# EAGLE design JOYPAD (EAGLE 9.6.2)
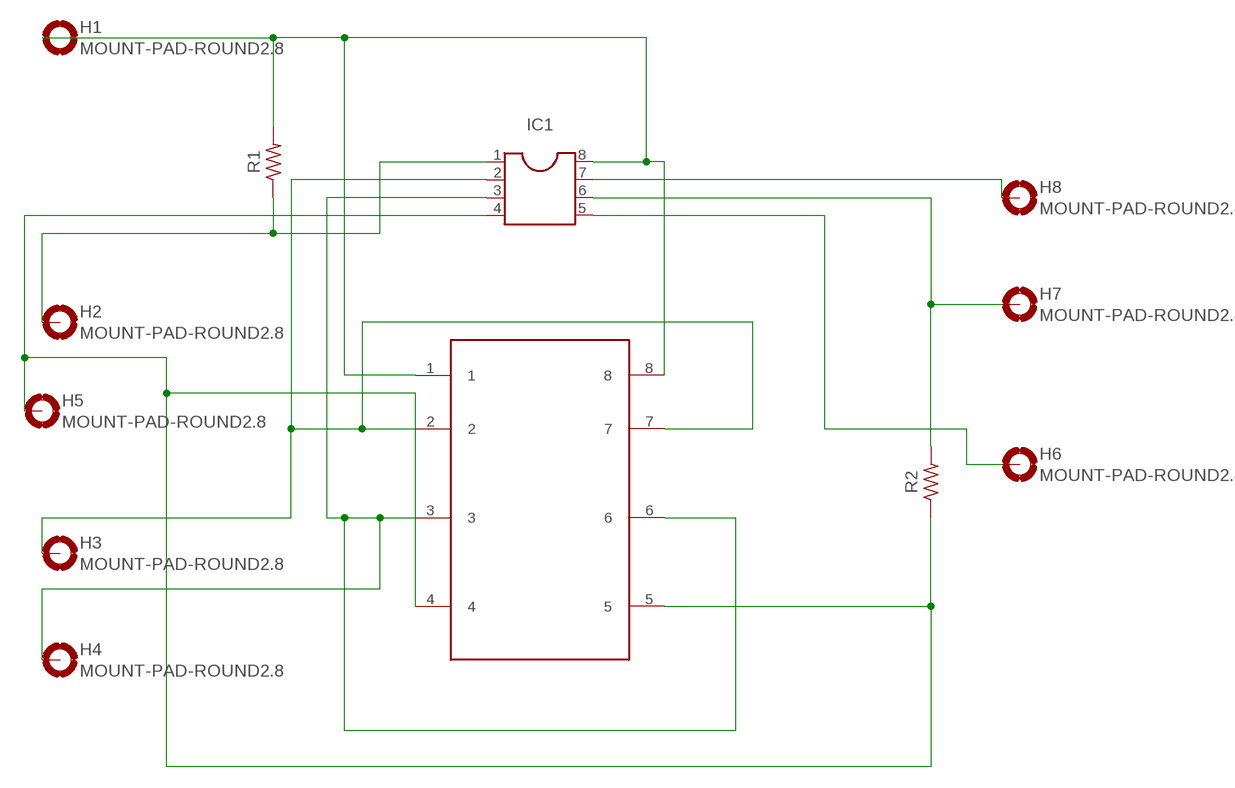
[diagram p0: schematic, sheet 1]

## Parts
H1  MOUNT-PAD-ROUND2.8  [2,8-PAD]
H2  MOUNT-PAD-ROUND2.8  [2,8-PAD]
H3  MOUNT-PAD-ROUND2.8  [2,8-PAD]
H4  MOUNT-PAD-ROUND2.8  [2,8-PAD]
H5  MOUNT-PAD-ROUND2.8  [2,8-PAD]
H6  MOUNT-PAD-ROUND2.8  [2,8-PAD]
H7  MOUNT-PAD-ROUND2.8  [2,8-PAD]
H8  MOUNT-PAD-ROUND2.8  [2,8-PAD]
IC1  DIL8  [DIL08]
R1  R-US_AXIAL-7.2MM-PITCH  [RESAD724W46L381D178B]
R2  R-US_AXIAL-7.2MM-PITCH  [RESAD724W46L381D178B]
U$1  JOYPAD  [JOYPAD]

## Nets
N$1: H1.B2,8(MOUNT) IC1.8 R1.2 U$1.1 U$1.8
N$2: H2.B2,8(MOUNT) IC1.1 R1.1
N$4: H3.B2,8(MOUNT) IC1.2 U$1.2 U$1.7
N$5: H4.B2,8(MOUNT) IC1.3 U$1.3 U$1.6
N$6: H5.B2,8(MOUNT) IC1.4 R2.1 U$1.4 U$1.5
N$7: H7.B2,8(MOUNT) IC1.6 R2.2
N$8: H8.B2,8(MOUNT) IC1.7
N$10: H6.B2,8(MOUNT) IC1.5

## Library data of the parts
H1-H8 = holes:MOUNT-PAD-ROUND: MOUNTING PAD, round
IC1 = ic-package:DIL8: Dual In Line / Socket
R1 R2 = Resistor:R-US: Resistor Fixed - ANSI; CATEGORY: Resistor; SUB-CATEGORY: Fixed
U$1 = JOYPAD:JOYPAD

## Board
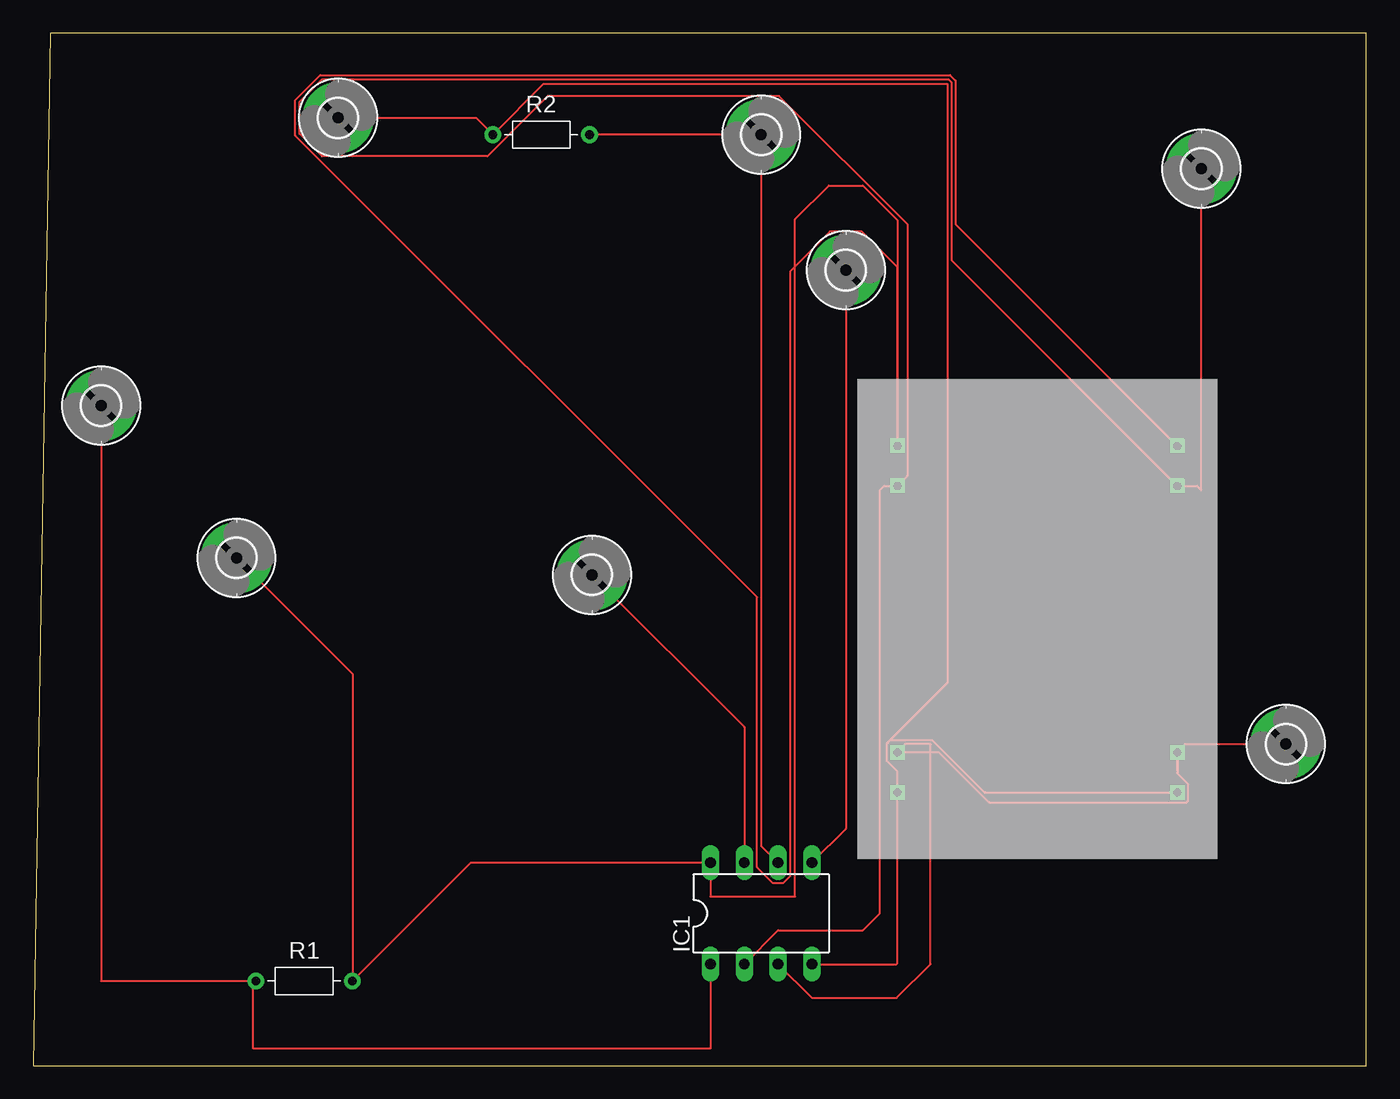
[diagram p1: board, top side]

Size 100 x 77.46 mm. Coordinates in mm from the lower left corner, seen from the top.
Outline: 0,0 100,0 100,77.46 1.27,77.46 0,0
Copper layers (1*16): Top 0.035mm / dielectric 1.5mm / Bottom 0.035mm
Design rules "default": minimum track width 6mil, minimum drill 0.35mm, track to track 6mil, track to pad 6mil, pad to pad 6mil, via to via 6mil, smd to smd 6mil, copper to edge 40mil, drill to drill 6mil, minimum pad ring 10mil, minimum via ring 8mil, stop-mask expansion 4mil, vias tented up to drill 0mil, thermal gap 10mil

### Footprints (pad centres in the part's own frame; a part is rotated, then mirrored left to right if it is on the bottom)
2,8-PAD = drill 2.8 pad 5.334: B2,8 0,0
DIL08 = drill 0.813 long: 1 -3.81,-3.81; 2 -1.27,-3.81; 3 1.27,-3.81; 4 3.81,-3.81; 5 3.81,3.81; 6 1.27,3.81; 7 -1.27,3.81; 8 -3.81,3.81
RESAD724W46L381D178B = drill 0.66 pad 1.26: 1 -3.62,0; 2 3.62,0
JOYPAD = drill 0.6 square: 1 -19,30; 2 -19,27; 3 -19,7; 4 -19,4; 5 2,4; 6 2,7; 7 2,27; 8 2,30

### Placement (x,y rotation side)
H1  15.24,38.1 0 top
H2  5.08,49.53 0 top
H3  87.63,67.31 0 top
H4  93.98,24.13 0 top
H5  22.86,71.12 0 top
H6  60.96,59.69 0 top
H7  54.61,69.85 0 top
H8  41.91,36.83 0 top
IC1  54.61,11.43 0 top
R1  20.32,6.35 0 top
R2  38.1,69.85 0 top
U$1  83.82,16.51 0 top

### Tracks (layer width: path | path; a pad name or v marks a point on that pad's centre or on a via)
N$1
  Top 0.152: H1.B2,8 23.94,29.4 R1.2 32.83,15.24 IC1.8 50.8,12.7 57.15,12.7 57.15,63.5 59.69,66.04 62.23,66.04 64.82,63.45 U$1.1 64.82,59.93 62.16,62.59 59.76,62.59 56.77,59.59 56.77,14.21 56.25,13.69 55.51,13.69 54.3,14.9 54.3,35.15 19.66,69.79 19.66,72.45 21.53,74.32 68.78,74.32 69.19,73.91 69.19,63.14 U$1.8
N$2
  Top 0.152: H2.B2,8 5.08,6.35 16.51,6.35 | 16.51,6.35 R1.1 | IC1.1 50.8,1.27 16.51,1.27 16.51,6.35
N$4
  Top 0.152: IC1.2 55.88,10.16 62.23,10.16 63.5,11.43 63.5,43.18 63.83,43.51 U$1.2 65.6,44.29 65.6,63.1 55.95,72.75 38.59,72.75 34.07,68.22 21.66,68.22 19.96,69.92 19.96,72.32 21.66,74.02 68.65,74.02 68.88,73.79 68.88,60.45 U$1.7 87.3,43.51 87.63,43.18 H3.B2,8
N$5
  Top 0.152: IC1.3 58.42,5.08 64.77,5.08 67.31,7.62 67.31,24.13 65.44,24.13 U$1.3 67.93,23.51 71.71,19.73 86.47,19.73 86.6,19.86 86.6,21.16 85.82,21.94 U$1.6 86.44,24.13 H4.B2,8
N$6
  Top 0.152: H5.B2,8 33.21,71.12 R2.1 38.29,73.66 68.58,73.66 68.58,28.7 64.31,24.44 | IC1.4 64.77,7.62 64.82,7.67 U$1.4 64.82,22.08 64.04,22.86 64.04,24.16 64.31,24.44 | U$1.5 71.36,20.51 67.44,24.44 64.31,24.44
N$7
  Top 0.152: R2.2 H7.B2,8 54.61,16.51 IC1.6
N$8
  Top 0.152: H8.B2,8 53.34,25.4 IC1.7
N$10
  Top 0.152: H6.B2,8 60.96,17.78 IC1.5